# Altium project Controller.PrjPCB
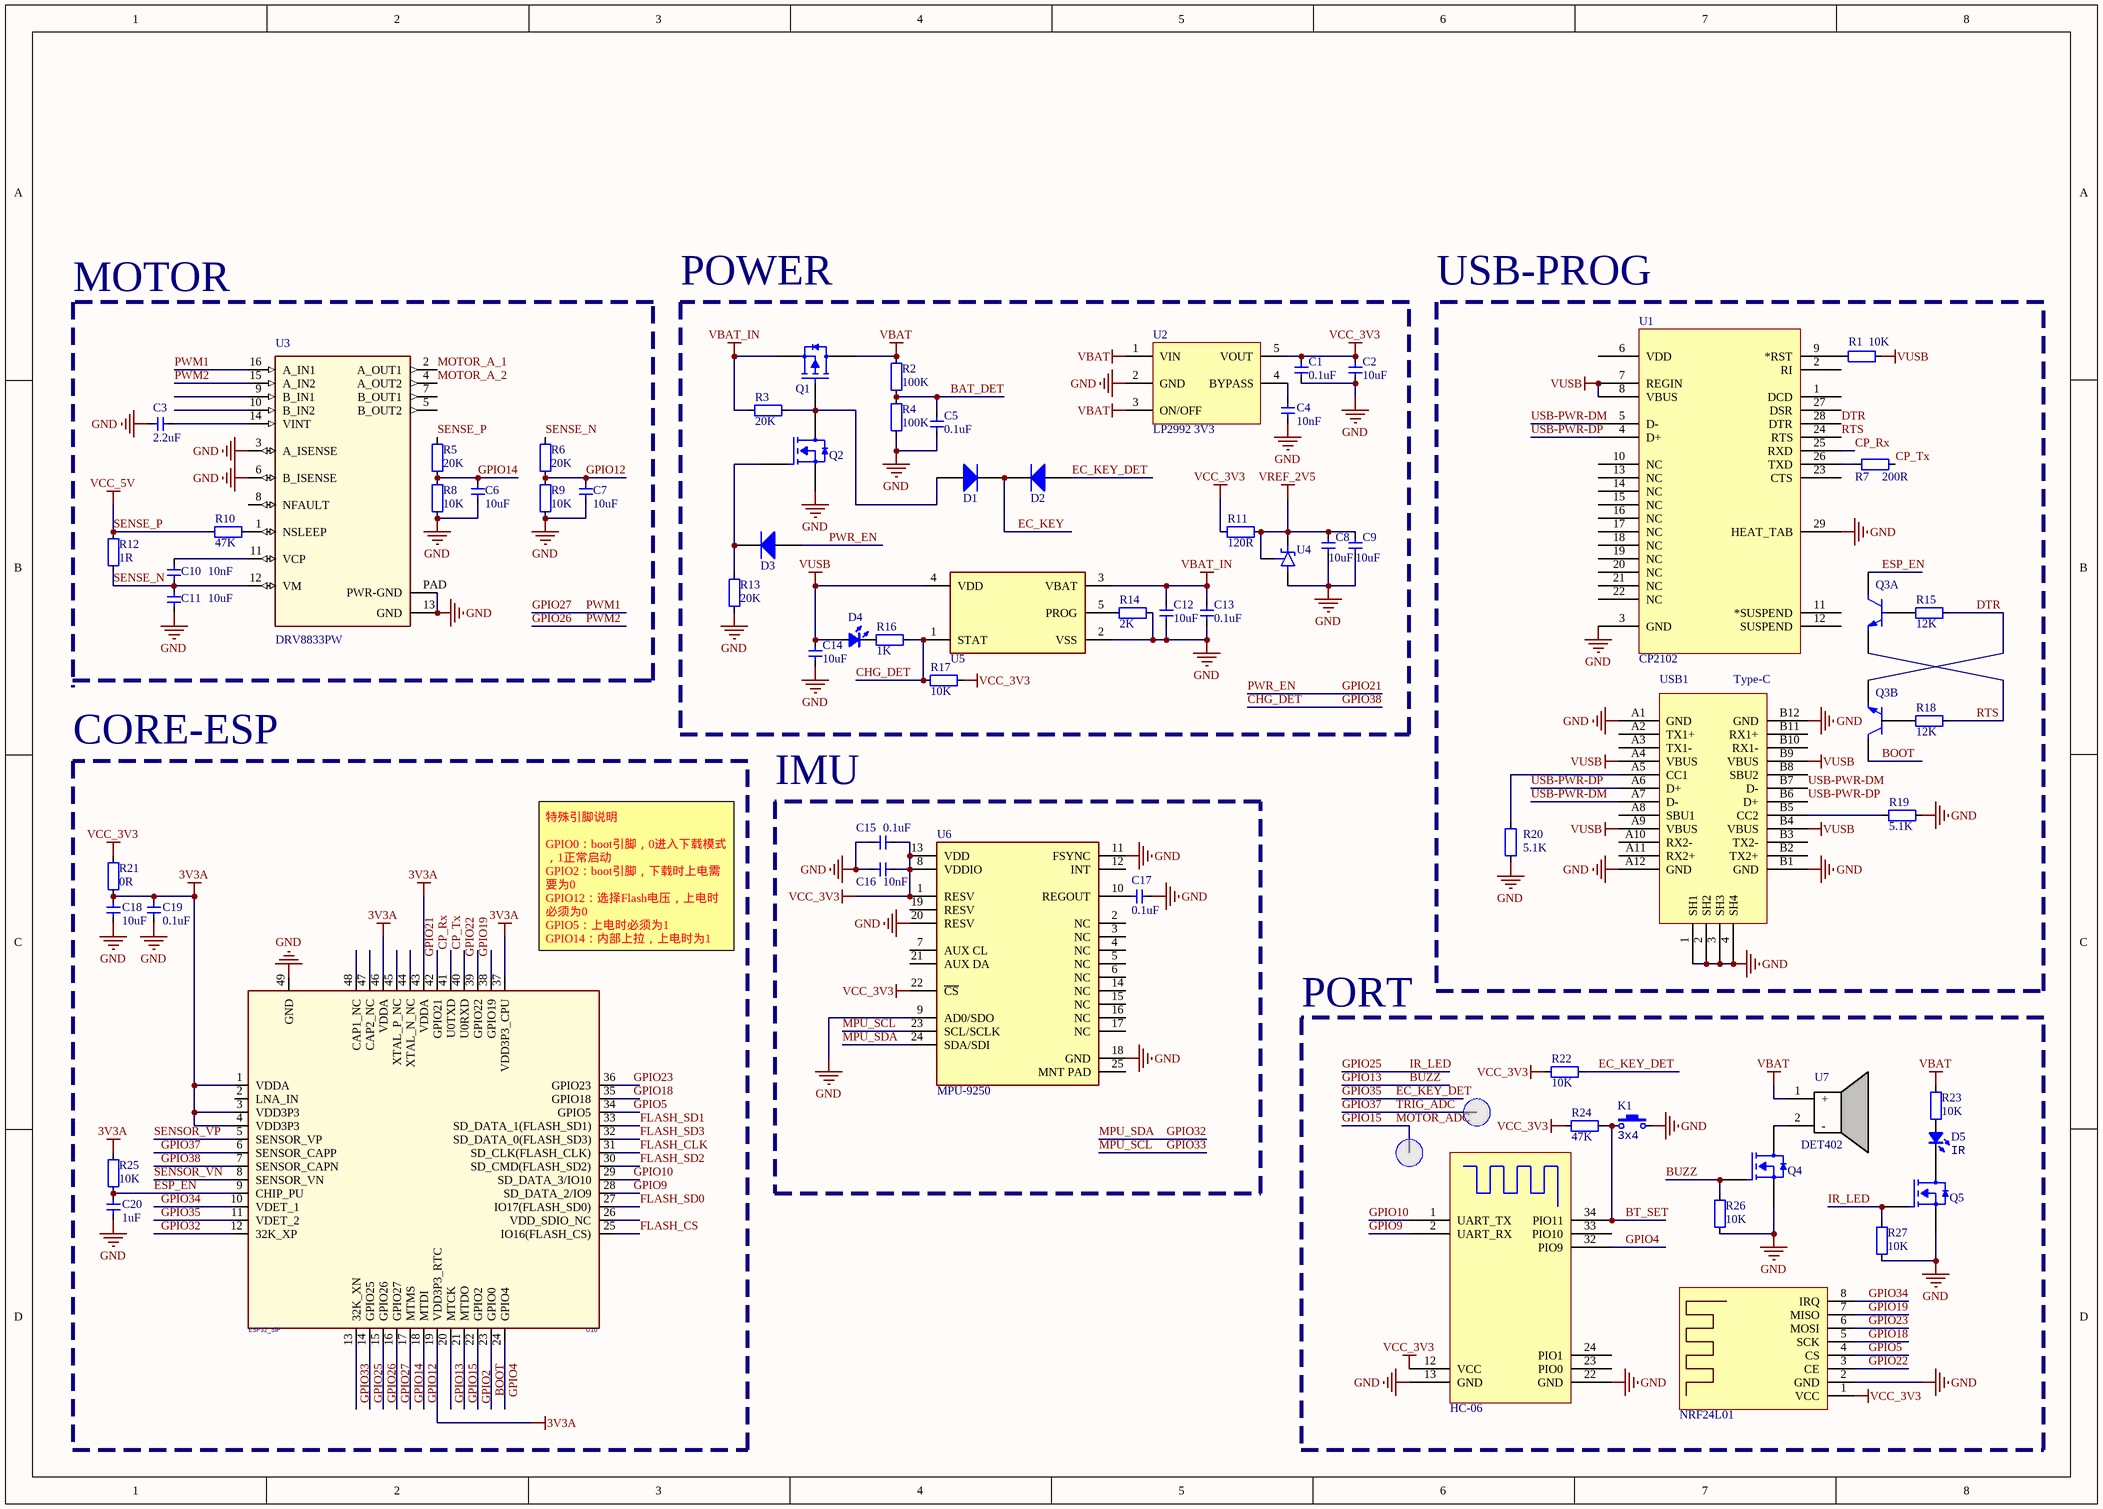
[diagram p0: Main.SchDoc]
1 sheet, 71 parts. Net scope: hierarchical (ports join the sheet entries above them; power ports are global).
Board file: Controller.PcbDoc

## Sheet Main.SchDoc
size A3; SheetNumber: 1

### Parts
C1  0.1uF  [CAP_0402]
C2  10uF  [CAP_0402]
C3  2.2uF  [CAP_0402]
C4  10nF  [CAP_0402]
C5  0.1uF  [CAP_0402]
C6  10uF  [CAP_0402]
C7  10uF  [CAP_0402]
C8  10uF  [CAP_0402]
C9  10uF  [CAP_0402]
C10  10nF  [CAP_0402]
C11  10uF  [CAP_0402]
C12  10uF  [CAP_0402]
C13  0.1uF  [CAP_0402]
C14  10uF  [CAP_0402]
C15  0.1uF  [CAP_0402]
C16  10nF  [CAP_0402]
C17  0.1uF  [CAP_0402]
C18  10uF  [CAP_0402]
C19  0.1uF  [CAP_0402]
C20  1uF  [CAP_0402]
D1  二极管-5819W  [SOD-323]  (value not drawn)
D2  二极管-5819W  [SOD-323]  (value not drawn)
D3  二极管-5819W  [SOD-323]  (value not drawn)
D4  color?  [LED_0402_RED]  (value not drawn)
D5  Type: IR  [LED_0805_RED]  (hidden comment: color?)
K1  value 3x4  [ButtonTACT_3x4x2_180]  (hidden comment: TACT 2P)
Q1  AO3401A  [SOT23-3]  (value not drawn)
Q2  AO3400A  [SOT23-3]  (value not drawn)
Q3  BC847BVC-7  [SOT563-6]  (value not drawn)  (parts A,B of 2)
Q4  AO3400A  [SOT23-3]  (value not drawn)
Q5  AO3400A  [SOT23-3]  (value not drawn)
R1  10K  [RES_0402]
R2  100K  [RES_0402]
R3  20K  [RES_0402]
R4  100K  [RES_0402]
R5  20K  [RES_0402]
R6  20K  [RES_0402]
R7  200R  [RES_0402]
R8  10K  [RES_0402]
R9  10K  [RES_0402]
R10  47K  [RES_0402]
R11  120R  [RES_0402]
R12  1R  [1206-RES]
R13  20K  [RES_0402]
R14  2K  [RES_0402]
R15  12K  [RES_0402]
R16  1K  [RES_0402]
R17  10K  [RES_0402]
R18  12K  [RES_0402]
R19  5.1K  [RES_0402]
R20  5.1K  [RES_0402]
R21  0R  [RES_0402]
R22  10K  [RES_0402]
R23  10K  [RES_0402]
R24  47K  [RES_0402]
R25  10K  [RES_0402]
R26  10K  [RES_0402]
R27  10K  [RES_0402]
T1  测试点  [TEST_PT]  (value not drawn)
T2  测试点  [TEST_PT]  (value not drawn)
U1  CP2102  [QFN-28]
U2  LP2992 3V3  [SOT23-5]
U3  DRV8833PW  [TSSOP-16]
U4  TL431IDBZT  [SOT23-3]  (value not drawn)
U5  MCP73831T  [SOT23-5]  (value not drawn)
U6  Part Number: MPU-9250  [QFN-24-3x3]  (hidden comment: MPU9250)
U7  DET402  [DET402]
U8  HC-06  [蓝牙模块HC-06]
U9  NRF24L01  [NRF24L01-MODULE]
U10  ESP32_SIP  [QFN-48_7X7]
USB1  Type-C  [Type-C-TOP]

### Blocks framed on the sheet
POWER: C1 C2 C4 C5 C8 C9 C12-C14 D1-D4 Q1 Q2 R2-R4 R11 R13 R14 R16 R17 U2 U4 U5
USB-PROG: Q3 R1 R7 R15 R18-R20 U1 USB1
CORE-ESP: C18-C20 R21 R25 U10
IMU: C15-C17 U6
PORT: D5 K1 Q4 Q5 R22-R24 R26 R27 T1 T2 U7-U9

### Nets
3V3A: C18.2 C19.2 R21.2 R25.1 U10.1(VDDA) U10.3(VDD3P3) U10.4(VDD3P3) U10.19(VDD3P3_RTC) U10.37(VDD3P3_CPU) U10.43(VDDA) U10.46(VDDA)
GND: C1.1 C2.1 C3.1 C4.1 C5.1 C6.1 C7.1 C8.1 C9.1 C11.1 C12.1 C13.1 C14.1 C15.2 C16.2 C17.1 C18.1 C19.1 C20.2 K1.2 Q2.2(S) Q4.2(S) Q5.2(S) R4.1 R8.1 R9.1 R13.1 R14.2 R19.1 R20.2 R26.1 R27.1 U1.3(GND) U1.29(HEAT_TAB) U2.2(GND) U3.3(A_ISENSE) U3.6(B_ISENSE) U3.13(GND) U3.PAD(PWR-GND) U4.3(ANODE) U5.2(VSS) U6.9(AD0/SDO) U6.11(FSYNC) U6.18(GND) U6.20(RESV) U8.13(GND) U8.22(GND) U9.2(GND) U10.49(GND) USB1.1(SH1) USB1.2(SH2) USB1.3(SH3) USB1.4(SH4) USB1.A1(GND) USB1.A12(GND) USB1.B1(GND) USB1.B12(GND)
VBAT: Q1.3(D) R2.2 R23.2 U2.1(VIN) U2.3(ON/OFF) U7.1(+)
VBAT_IN: C12.2 C13.2 Q1.2(S) R3.1 U5.3(VBAT)
VCC_3V3: C1.2 C2.2 C15.1 C16.1 R11.1 R17.2 R21.1 R22.1 R24.1 U2.5(VOUT) U6.1(RESV) U6.8(VDDIO) U6.13(VDD) U6.22(~{CS}) U8.12(VCC) U9.1(VCC)
VCC_5V: R5.2 R10.2 R12.2  [also labelled SENSE_P]
VREF_2V5: C8.2 C9.2 R11.2 U4.1(CATHODE) U4.2(REF)
VUSB: C14.2 D4.1(A) R1.1 U1.7(REGIN) U1.8(VBUS) U5.4(VDD) USB1.A4(VBUS) USB1.A9(VBUS) USB1.B4(VBUS) USB1.B9(VBUS)
BAT_DET: C5.2 R2.1 R4.2  [project net BAT_DET_1]
BOOT: Q3.3(C2) U10.23(GPIO0)  [project net BOOT_1]
BT_SET: K1.1 R24.2 U8.34(PIO11)  [project net BT_SET_1]
BUZZ: Q4.1(G) R26.2 U10.20(MTCK)  [also labelled GPIO13]  [project net BUZZ_1]
CHG_DET: R16.2 R17.1 U5.1(STAT) U10.7(SENSOR_CAPN)  [also labelled GPIO38]  [project net CHG_DET_1]
CP_Rx: U1.25(RXD) U10.41(U0TXD)  [project net CP_Rx_1]
CP_Tx: R7.1 U10.40(U0RXD)  [project net CP_Tx_1]
DTR: Q3.4(E2) R15.1 U1.28(DTR)  [project net DTR_1]
EC_KEY: D1.2(K) D2.2(K)  [project net EC_KEY_1]
EC_KEY_DET: D2.1(A) R22.2 U10.11(VDET_2)  [also labelled GPIO35]  [project net EC_KEY_DET_1]
ESP_EN: C20.1 Q3.6(C1) R25.2 U10.9(CHIP_PU)  [project net ESP_EN_1]
FLASH_CLK: U10.31(SD_CLK(FLASH_CLK))  [project net FLASH_CLK_1]
FLASH_CS: U10.25(IO16(FLASH_CS))  [project net FLASH_CS_1]
FLASH_SD0: U10.27(IO17(FLASH_SD0))  [project net FLASH_SD0_1]
FLASH_SD1: U10.33(SD_DATA_1(FLASH_SD1))  [project net FLASH_SD1_1]
FLASH_SD2: U10.30(SD_CMD(FLASH_SD2))  [project net FLASH_SD2_1]
FLASH_SD3: U10.32(SD_DATA_0(FLASH_SD3))  [project net FLASH_SD3_1]
GPIO2: U10.22(GPIO2)  [project net GPIO2_1]
GPIO4: U8.32(PIO9) U10.24(GPIO4)  [project net GPIO4_1]
GPIO5: U9.4(CS) U10.34(GPIO5)  [project net GPIO5_1]
GPIO9: U8.2(UART_RX) U10.28(SD_DATA_2/IO9)  [project net GPIO9_1]
GPIO10: U8.1(UART_TX) U10.29(SD_DATA_3/IO10)  [project net GPIO10_1]
GPIO12: C7.2 R6.1 R9.2 U10.18(MTDI)  [project net GPIO12_1]
GPIO14: C6.2 R5.1 R8.2 U10.17(MTMS)  [project net GPIO14_1]
GPIO15: T2.0 U10.21(MTDO)  [also labelled MOTOR_ADC]  [project net GPIO15_1]
GPIO18: U9.5(SCK) U10.35(GPIO18)  [project net GPIO18_1]
GPIO19: U9.7(MISO) U10.38(GPIO19)  [project net GPIO19_1]
GPIO21: D3.1(A) U10.42(GPIO21)  [also labelled PWR_EN]  [project net GPIO21_1]
GPIO22: U9.3(CE) U10.39(GPIO22)  [project net GPIO22_1]
GPIO23: U9.6(MOSI) U10.36(GPIO23)  [project net GPIO23_1]
GPIO25: Q5.1(G) R27.2 U10.14(GPIO25)  [also labelled IR_LED]  [project net GPIO25_1]
GPIO26: U3.15(A_IN2) U10.15(GPIO26)  [also labelled PWM2]  [project net GPIO26_1]
GPIO27: U3.16(A_IN1) U10.16(GPIO27)  [also labelled PWM1]  [project net GPIO27_1]
GPIO32: U6.24(SDA/SDI) U10.12(32K_XP)  [also labelled MPU_SDA]  [project net GPIO32_1]
GPIO33: U6.23(SCL/SCLK) U10.13(32K_XN)  [also labelled MPU_SCL]  [project net GPIO33_1]
GPIO34: U9.8(IRQ) U10.10(VDET_1)  [project net GPIO34_1]
GPIO37: T1.0 U10.6(SENSOR_CAPP)  [also labelled TRIG_ADC]  [project net GPIO37_1]
MOTOR_A_1: U3.2(A_OUT1)  [project net MOTOR_A_1_1]
MOTOR_A_2: U3.4(A_OUT2)  [project net MOTOR_A_2_1]
RTS: Q3.1(E1) R18.1 U1.24(RTS)  [project net RTS_1]
SENSE_N: C10.1 C11.2 R6.2 R12.1 U3.12(VM)  [project net SENSE_N_1]
SENSOR_VN: U10.8(SENSOR_VN)  [project net SENSOR_VN_1]
SENSOR_VP: U10.5(SENSOR_VP)  [project net SENSOR_VP_1]
USB-PWR-DM: U1.5(D-) USB1.A7(D-) USB1.B7(D-)  [project net USB-PWR-DM_1]
USB-PWR-DP: U1.4(D+) USB1.A6(D+) USB1.B6(D+)  [project net USB-PWR-DP_1]
NetC3_2: C3.2 U3.14(VINT)
NetC4_2: C4.2 U2.4(BYPASS)
NetC10_2: C10.2 U3.11(VCP)
NetC17_2: C17.2 U6.10(REGOUT)
NetD1_1: D1.1(A) Q1.1(G) Q2.3(D) R3.2
NetD3_2: D3.2(K) Q2.1(G) R13.2
NetD4_2: D4.2(K) R16.1
NetD5_1: D5.1(A) R23.1
NetD5_2: D5.2(K) Q5.3(D)
NetQ3_2: Q3.2(B1) R15.2
NetQ3_5: Q3.5(B2) R18.2
NetQ4_3: Q4.3(D) U7.2(-)
NetR1_2: R1.2 U1.9(*RST)
NetR7_2: R7.2 U1.26(TXD)
NetR10_1: R10.1 U3.1(NSLEEP)
NetR14_1: R14.1 U5.5(PROG)
NetR19_2: R19.2 USB1.B5(CC2)
NetR20_1: R20.1 USB1.A5(CC1)

Not connected (* = marked no-connect by the designer): U1 1(DCD) 2(RI) 6(VDD) 10(NC) 11(*SUSPEND) 12(SUSPEND) 13(NC) 14(NC) 15(NC) 16(NC) 17(NC) 18(NC) 19(NC) 20(NC) 21(NC) 22(NC) 23(CTS) 27(DSR); U3 5(B_OUT2) 7(B_OUT1) 8(NFAULT) 9(B_IN1) 10(B_IN2); U6 2(NC) 3(NC) 4(NC) 5(NC) 6(NC) 7(AUX_CL) 12(INT) 14(NC) 15(NC) 16(NC) 17(NC) 19(RESV) 21(AUX_DA) 25(MNT_PAD); U8 23(PIO0) 24(PIO1) 33(PIO10); U10 2(LNA_IN) 26(VDD_SDIO_NC) 44(XTAL_N_NC) 45(XTAL_P_NC) 47(CAP2_NC) 48(CAP1_NC); USB1 A2(TX1+) A3(TX1-) A8(SBU1) A10(RX2-) A11(RX2+) B2(TX2+) B3(TX2-) B8(SBU2) B10(RX1-) B11(RX1+)

### Notes on the sheet
- MOTOR
- (near U10) 特殊引脚说明
  GPIO0：boot引脚，0进入下载模式，1正常启动
  GPIO2：boot引脚，下载时上电需要为0
  GPIO12：选择Flash电压，上电时必须为0
  GPIO5：上电时必须为1
  GPIO14：内部上拉，上电时为1
  GPIO15：上电时必须为1

### Library data of the parts
C1-C20 = 电容-0402: Capacitor; Value: 0.1u
D1-D3 = 二极管-5819W: 40V
D4 = LED_0402: LED; Type: 0402; Value: color?
D5 = LED_0805: LED; Value: color?
K1 = ButtonTACT_3x4x2_180: Button; type: TACT 2P
Q1 = AO3401A: P-MOS
Q2 Q4 Q5 = AO3400A: N-MOS
R1-R11 R13-R27 = 电阻-0402: Resistor; Value: 22R
R12 = 电阻-1206: Resistor; Value: 22R
U1 = CP2102: USB转TTL; PART DESC: SINGLE-CHIP USB TO UART BRIDGE, QFN28, RoHS.; MFG #1: SILICON LABS; PART NUMBER: CP2102; Value: Value; RefDes: RefDes; Type: DEV
U2 = LP2992: LDO
U4 = TL431IDBZT: Adjustable precision shunt regulator 3-SOT-23 -40 to 85; MF: Texas Instruments; Price: None; Package: SOT-23-3 Texas Instruments; Check_prices: https://www.snapeda.com/parts/TL431IDBZT/Texas%20Instruments/view-part/1206577/?ref=eda; Availability: Warning; MP: TL431IDBZT; Value: *; SnapEDA_Link: https://www.snapeda.com/parts/TL431IDBZT/Texas%20Instruments/view-part/1206577/?ref=snap; Purchase-URL: https://pricing.snapeda.com/search/part/TL431IDBZT/?ref=eda
U6 = MPU9250: IC IMU ACCEL/GYRO/MAG I2C/SPI 24QFN; Manufacturer: TDK InvenSense; helpURL: https://upverter.com/upn/revision/45d9ab674e6b8452/; ComponentLink2Description: Datasheet; Temperature: -40°C to +85°C; Package: QFN24; Supplier 2: Mouser; Supplier 1: Digi-Key; ComponentLink1URL: https://upverter.com/upn/revision/45d9ab674e6b8452/; Supplier Part Number 2: 410-MPU-9250; Supplier Part Number 1: 1428-1019-1-ND; ComponentLink1Description: Upverter; ComponentLink2URL: https://store.invensense.com/datasheets/invensense/MPU9250REV1.0.pdf; RoHS: TRUE; Mouser Part Number: 410-MPU-9250; Ipc Land Pattern Name: QFN40P300X300X100-24; Temperature Range High: +85°C; Digikey Description: IC IMU ACCEL/GYRO/MAG I2C/SPI 24QFN; Digikey Part Number: 1428-1019-1-ND; Lead Free: yes; Temperature Range Low: -40°C
U8 = 蓝牙模块HC-06
U9 = NRF24L01模块
U10 = ESP32-PICO
USB1 = USB-Type-C-TOP
U3 = DRV8833PW: SnapEDA_Link: https://www.snapeda.com/parts/DRV8833PW/Texas%20Instruments/view-part/507725/?ref=snap; Value: *